# Altium project PCB_Project1.PrjPCB
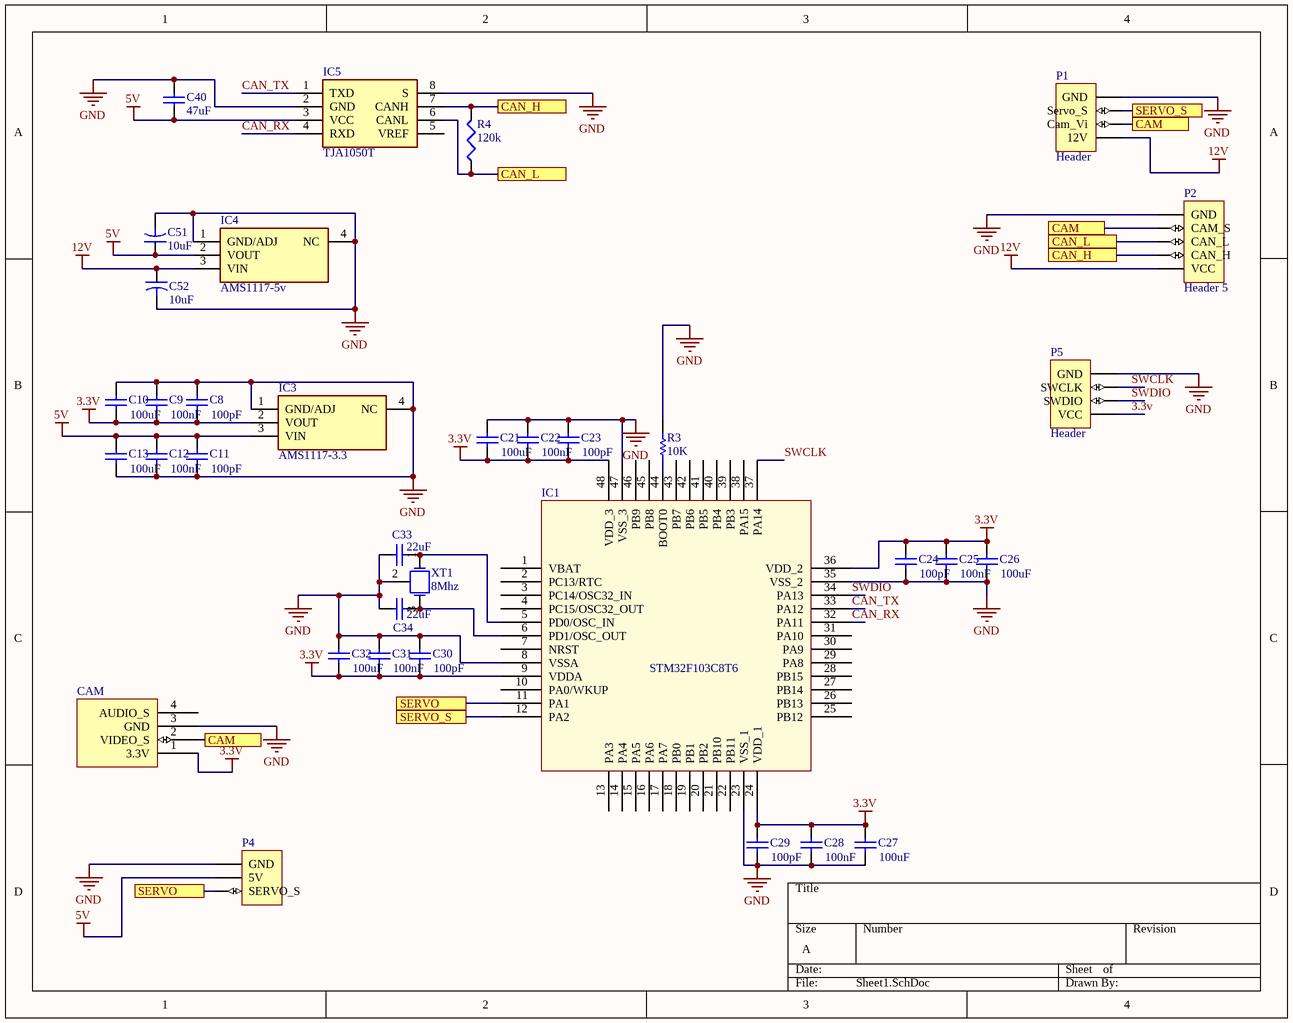
[diagram p0: Sheet1.SchDoc]
1 sheet, 35 parts. Net scope: flat (ports and power ports of the same name join across sheets).
Board file: PCB1.PcbDoc

## Sheet Sheet1.SchDoc
size A

### Parts
C8  value 100pF  [C0805]  (hidden comment: Cap Semi)
C9  value 100nF  [C0805]  (hidden comment: Cap Semi)
C10  value 100uF  [C0805]  (hidden comment: Cap Semi)
C11  value 100pF  [C0805]  (hidden comment: Cap Semi)
C12  value 100nF  [C0805]  (hidden comment: Cap Semi)
C13  value 100uF  [C0805]  (hidden comment: Cap Semi)
C21  value 100uF  [C0805]  (hidden comment: Cap Semi)
C22  value 100nF  [C0805]  (hidden comment: Cap Semi)
C23  value 100pF  [C0805]  (hidden comment: Cap Semi)
C24  value 100pF  [C0805]  (hidden comment: Cap Semi)
C25  value 100nF  [C0805]  (hidden comment: Cap Semi)
C26  value 100uF  [C0805]  (hidden comment: Cap Semi)
C27  value 100uF  [C0805]  (hidden comment: Cap Semi)
C28  value 100nF  [C0805]  (hidden comment: Cap Semi)
C29  value 100pF  [C0805]  (hidden comment: Cap Semi)
C30  value 100pF  [C0805]  (hidden comment: Cap Semi)
C31  value 100nF  [C0805]  (hidden comment: Cap Semi)
C32  value 100uF  [C0805]  (hidden comment: Cap Semi)
C33  22uF  [C0805]
C34  22uF  [C0805]
C40  value 47uF  [C0805]  (hidden comment: Cap Semi)
C51  value 10uF  [CAPR5-4X5]  (hidden comment: Cap2)
C52  value 10uF  [CAPR5-4X5]  (hidden comment: Cap2)
CAM  CAM  [PCBComponent_1]  (value not drawn)
IC1  STM32F103C8T6  [LQFP48]
IC3  AMS1117-3.3  [SOT229P700X180-4N]
IC4  AMS1117-5v  [SOT229P700X180-4N]
IC5  TJA1050T  [SOIC127P600X175-8N]
P1  Header  [HDR1X4]
P2  Header 5  [HDR1X5]
P4  Header 3  [HDR1X3]  (value not drawn)
P5  Header  [HDR1X4]
R3  10K  [R0805]
R4  value 120k  [R0805]  (hidden comment: 120R)
XT1  8Mhz  [3225-P]

### Ports
CAM, CAN_H, CAN_L, SERVO, SERVO_S

### Nets
3.3v: C8.1 C9.1 C10.1 C21.1 C22.1 C23.1 C24.2 C25.2 C26.2 C27.2 C28.2 C29.2 C30.1 C31.1 C32.1 CAM.1(3.3V) IC1.9(VDDA) IC1.24(VDD_1) IC1.36(VDD_2) IC1.48(VDD_3) IC3.2(VOUT) P5.1(VCC)
5V: C11.2 C12.2 C13.2 C40.1 C51.1 IC3.3(VIN) IC4.2(VOUT) IC5.3(VCC) P4.2(5V)
12V: C52.1 IC4.3(VIN) P1.1(12V) P2.5(VCC)
GND: C8.2 C9.2 C10.2 C11.1 C12.1 C13.1 C21.2 C22.2 C23.2 C24.1 C25.1 C26.1 C27.1 C28.1 C29.1 C30.2 C31.2 C32.2 C33.2 C34.2 C40.2 C51.2 C52.2 CAM.3(GND) IC1.8(VSSA) IC1.23(VSS_1) IC1.35(VSS_2) IC1.47(VSS_3) IC3.1(GND/ADJ) IC3.4(NC) IC4.1(GND/ADJ) IC4.4(NC) IC5.2(GND) IC5.8(S) P1.4(GND) P2.1(GND) P4.1(GND) P5.4(GND) R3.2 XT1.2
CAN_RX: IC1.32(PA11) IC5.4(RXD)
CAN_TX: IC1.33(PA12) IC5.1(TXD)
SWCLK: IC1.37(PA14) P5.3(SWCLK)
SWDIO: IC1.34(PA13) P5.2(SWDIO)
NetC33_1: C33.1 IC1.5(PD0/OSC_IN) XT1.1(OSC1)
NetC34_1: C34.1 IC1.6(PD1/OSC_OUT) XT1.3(OSC2)
NetCAM_2: CAM.2(VIDEO_S) P1.2(Cam_Vi) P2.2(CAM_S) ; port CAM
NetIC1_11: IC1.11(PA1) P4.3(SERVO_S) ; port SERVO
NetIC1_12: IC1.12(PA2) P1.3(Servo_S) ; port SERVO_S
NetIC1_44: IC1.44(BOOT0) R3.1
NetIC5_6: IC5.6(CANL) P2.3(CAN_L) R4.1 ; port CAN_L
NetIC5_7: IC5.7(CANH) P2.4(CAN_H) R4.2 ; port CAN_H

Not connected (* = marked no-connect by the designer): CAM 4(AUDIO_S); IC1 1(VBAT) 2(PC13/RTC) 3(PC14/OSC32_IN) 4(PC15/OSC32_OUT) 7(NRST) 10(PA0/WKUP) 13(PA3) 14(PA4) 15(PA5) 16(PA6) 17(PA7) 18(PB0) 19(PB1) 20(PB2) 21(PB10) 22(PB11) 25(PB12) 26(PB13) 27(PB14) 28(PB15) 29(PA8) 30(PA9) 31(PA10) 38(PA15) 39(PB3) 40(PB4) 41(PB5) 42(PB6) 43(PB7) 45(PB8) 46(PB9); IC5 5(VREF)

### Library data of the parts
C8-C13 C21-C32 C40 = Cap Semi: Capacitor (Semiconductor SIM Model); Published: 8-Jun-2000; LatestRevisionDate: 29-May-2009; LatestRevisionNote: IPC-7351 Footprint Added.; PackageReference: C1206; Publisher: Altium Limited; PackageDescription: Chip Capacitor
C33 C34 = Cap: value: *
C51 C52 = Cap2: Capacitor; Published: 23-Sep-2002; PackageReference: CAPR5-4X5; Publisher: Altium Limited; PackageDescription: Capacitor; 2 Leads
CAM = COMPONENT_1
IC3 IC4 = AMS1117-3.3: Integrated Circuit; Manufacturer_Name: Advanced; Datasheet Link: https://datasheet.datasheetarchive.com/originals/distributors/Datasheets-28/DSA-550594.pdf; Height: 1.8mm; Manufacturer_Part_Number: AMS1117-3.3
IC5 = TJA1050T: Integrated Circuit; Manufacturer_Name: NXP; Datasheet Link: https://datasheet.datasheetarchive.com/originals/distributors/Datasheets-NXP/DSANXP010005907.pdf; Height: 1.75mm; Manufacturer_Part_Number: TJA1050T; Mouser Part Number: N/A; Mouser Price/Stock: https://www.mouser.co.uk/ProductDetail/NXP-Semiconductors/TJA1050T?qs=WhRErS6oET%252B5mtiFrt9ZMQ%3D%3D
P1 P5 = Header 4: LatestRevisionDate: 17-Jul-2002; LatestRevisionNote: Re-released for DXP Platform.; Publisher: Altium Limited
P2 = Header 5: Header, 5-Pin; LatestRevisionDate: 17-Jul-2002; LatestRevisionNote: Re-released for DXP Platform.; Publisher: Altium Limited
P4 = Header 3: Header, 3-Pin; LatestRevisionDate: 17-Jul-2002; LatestRevisionNote: Re-released for DXP Platform.; Publisher: Altium Limited
R3 = Resistor_1: value: *
R4 = Res3: Resistor; Published: 8-Jun-2000; LatestRevisionDate: 29-May-2009; LatestRevisionNote: IPC-7351 Footprint Added.; PackageReference: J1-0603; Publisher: Altium Limited; PackageDescription: Chip Resistor
XT1 = Passive Crystal: frequency: *